# EAGLE design DSL40 switcher MIDI (EAGLE 9.6.2)
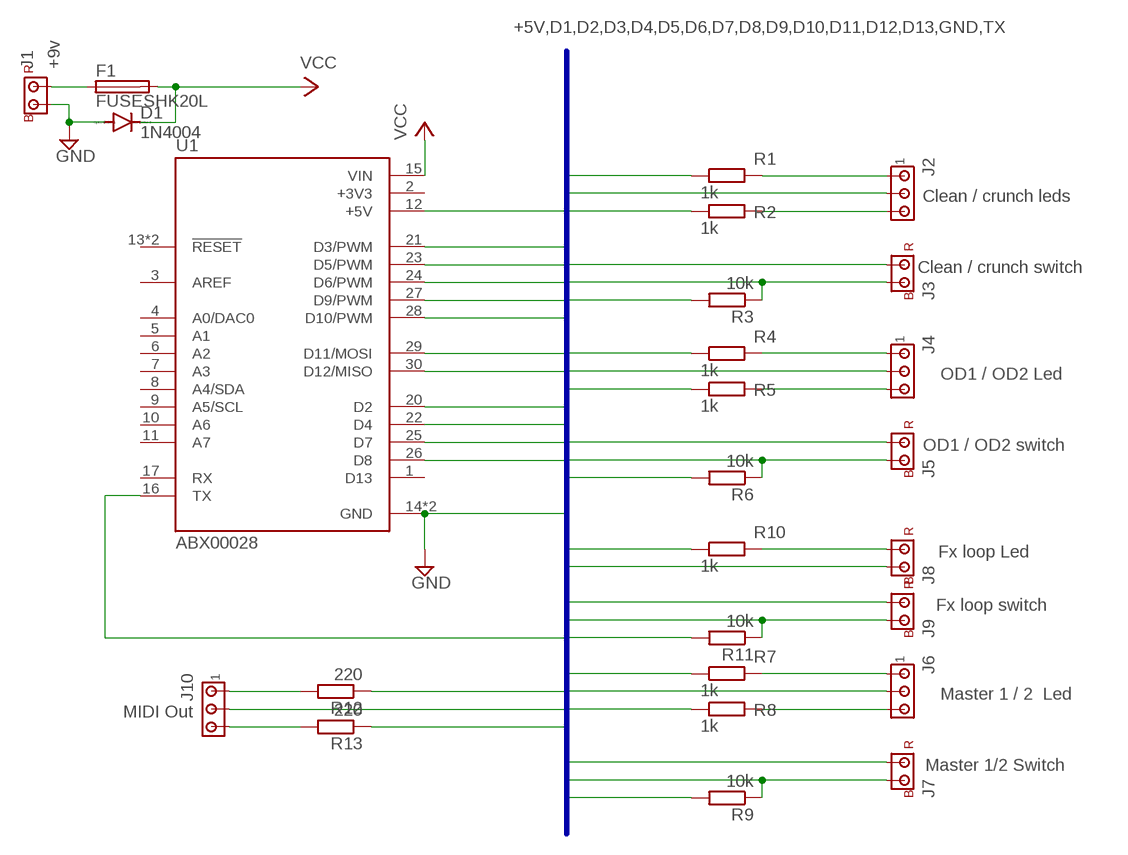
[diagram p0: schematic, sheet 1]

## Parts
D1  1N4004  [DO41-10]
F1  FUSESHK20L  [SHK20L]
J1  +9v  CONNECTOR-JST-2-2.54  [CONNECTOR-JST-2-2.54]
J2  Clean / crunch leds  CONNECTOR-JST-3-2.54  [CONNECTOR-JST-3-2.54]
J3  Clean / crunch switch  CONNECTOR-JST-2-2.54  [CONNECTOR-JST-2-2.54]
J4  OD1 / OD2 Led  CONNECTOR-JST-3-2.54  [CONNECTOR-JST-3-2.54]
J5  OD1 / OD2 switch  CONNECTOR-JST-2-2.54  [CONNECTOR-JST-2-2.54]
J6  Master 1 / 2 Led  CONNECTOR-JST-3-2.54  [CONNECTOR-JST-3-2.54]
J7  Master 1/2 Switch  CONNECTOR-JST-2-2.54  [CONNECTOR-JST-2-2.54]
J8  Fx loop Led  CONNECTOR-JST-2-2.54  [CONNECTOR-JST-2-2.54]
J9  Fx loop switch  CONNECTOR-JST-2-2.54  [CONNECTOR-JST-2-2.54]
J10  MIDI Out  CONNECTOR-JST-3-2.54  [CONNECTOR-JST-3-2.54]
R1  1k  R-EU_0207/10  [0207/10]
R2  1k  R-EU_0207/10  [0207/10]
R3  10k  R-EU_0207/10  [0207/10]
R4  1k  R-EU_0207/10  [0207/10]
R5  1k  R-EU_0207/10  [0207/10]
R6  10k  R-EU_0207/10  [0207/10]
R7  1k  R-EU_0207/10  [0207/10]
R8  1k  R-EU_0207/10  [0207/10]
R9  10k  R-EU_0207/10  [0207/10]
R10  1k  R-EU_0207/10  [0207/10]
R11  10k  R-EU_0207/10  [0207/10]
R12  220  R-EU_0207/10  [0207/10]
R13  220  R-EU_0207/10  [0207/10]
U1  ABX00028  [MODULE_ABX00028]

## Nets
+5V: J3.RED J5.RED J7.RED J9.RED R12.1 U1.12(+5V)
D2: J3.BLACK R3.1 U1.20(D2)
D3: R2.1 U1.21(D3/PWM)
D4: R1.1 U1.22(D4)
D5: J5.BLACK R6.1 U1.23(D5/PWM)
D6: R5.1 U1.24(D6/PWM)
D7: R4.1 U1.25(D7)
D8: J7.BLACK R9.1 U1.26(D8)
D9: R8.1 U1.27(D9/PWM)
D10: R7.1 U1.28(D10/PWM)
D11: R10.1 U1.29(D11/MOSI)
D12: J9.BLACK R11.1 U1.30(D12/MISO)
GND: D1.A J1.BLACK J2.BLACK J4.BLACK J6.BLACK J8.BLACK J10.BLACK R3.2 R6.2 R9.2 R11.2 U1.14(GND) U1.19(GND)
N$1: J2.YELLOW R2.2
N$2: J2.RED R1.2
N$3: J4.YELLOW R5.2
N$4: J4.RED R4.2
N$5: J8.RED R10.2
N$6: J6.RED R7.2
N$7: J6.YELLOW R8.2
N$8: J10.RED R12.2
N$9: J10.YELLOW R13.2
N$10: F1.1A J1.RED
TX: R13.1 U1.16(TX)
VCC: D1.C F1.2A U1.15(VIN)
Unconnected: U1.1(D13) U1.3(AREF) U1.4(A0/DAC0) U1.5(A1) U1.6(A2) U1.7(A3) U1.8(A4/SDA) U1.9(A5/SCL) U1.10(A6) U1.11(A7) U1.13(!RESET) U1.17(RX) U1.18(!RESET)

## Buses
+5V,D1,D2,D3,D4,D5,D6,D7,D8,D9,D10,D11,D12,D13,GND,TX

## Power pins joined to a net without a drawn wire
+3V3: U1.2(+3V3)

## Library data of the parts
D1 = diode:1N4004: DIODE general purpose rectifier, 1 A
F1 = fuse:FUSE: Fuse; OC_FARNELL: unknown; OC_NEWARK: unknown
J1 J3 J5 J7-J9 = christophe:CONNECTOR-JST-2-2.54: AMP connector
J2 J4 J6 J10 = christophe:CONNECTOR-JST-3-2.54: AMP connector
R1-R13 = christophe:R-EU_: RESISTOR, European symbol; SPICEPREFIX: R
U1 = Arduino every:ABX00028: Check availability <https://pricing.snapeda.com/parts/Arduino%20Nano%20Every/Arduino/view-part?ref=eda>; AVAILABILITY: In Stock; CHECK_PRICES: https://www.snapeda.com/parts/Arduino%20Nano%20Every/Arduino/view-part/?ref=eda; DESCRIPTION: Arduino’s 5V compatible board in the smallest available form factor: 45x18mm!; MF: Arduino; MP: Arduino Nano Every; PACKAGE: None; PRICE: None; SNAPEDA_LINK: https://www.snapeda.com/parts/Arduino%20Nano%20Every/Arduino/view-part/?ref=snap

## Board
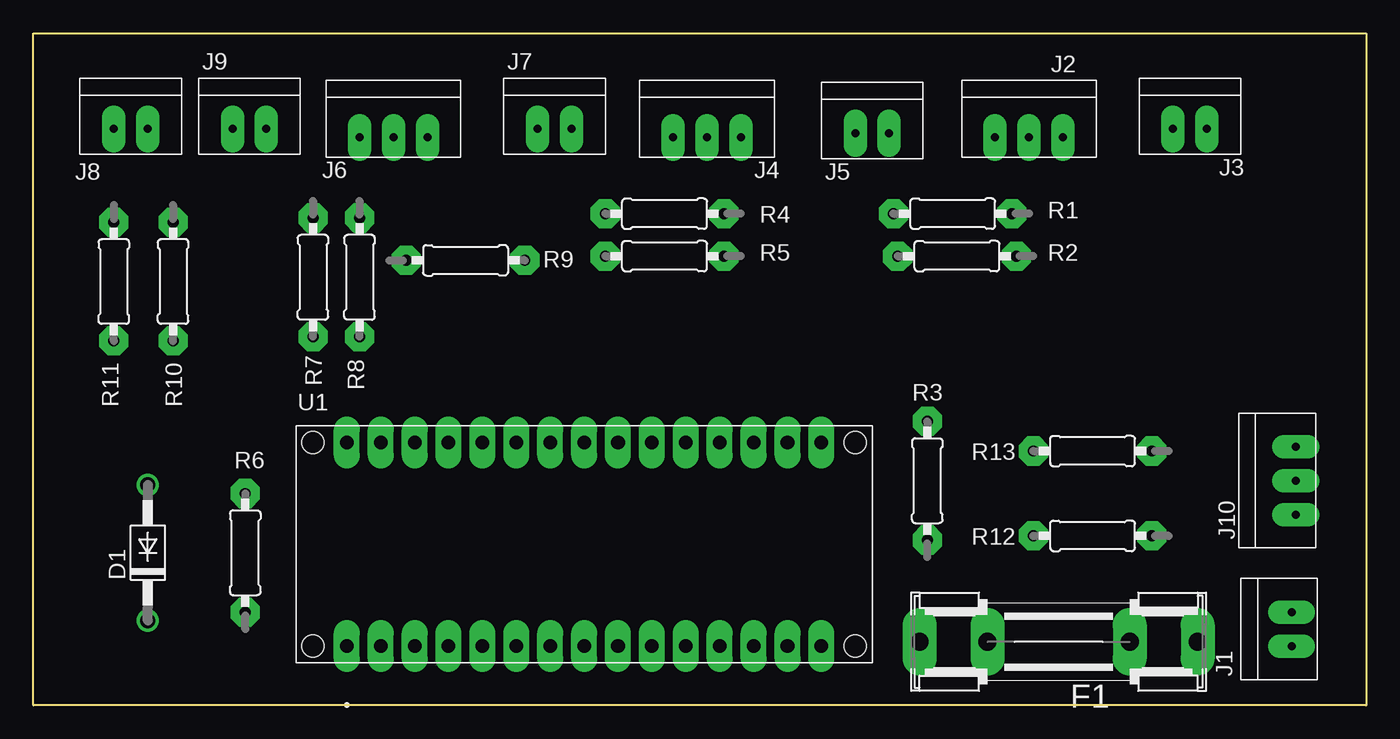
[diagram p1: board, top side]
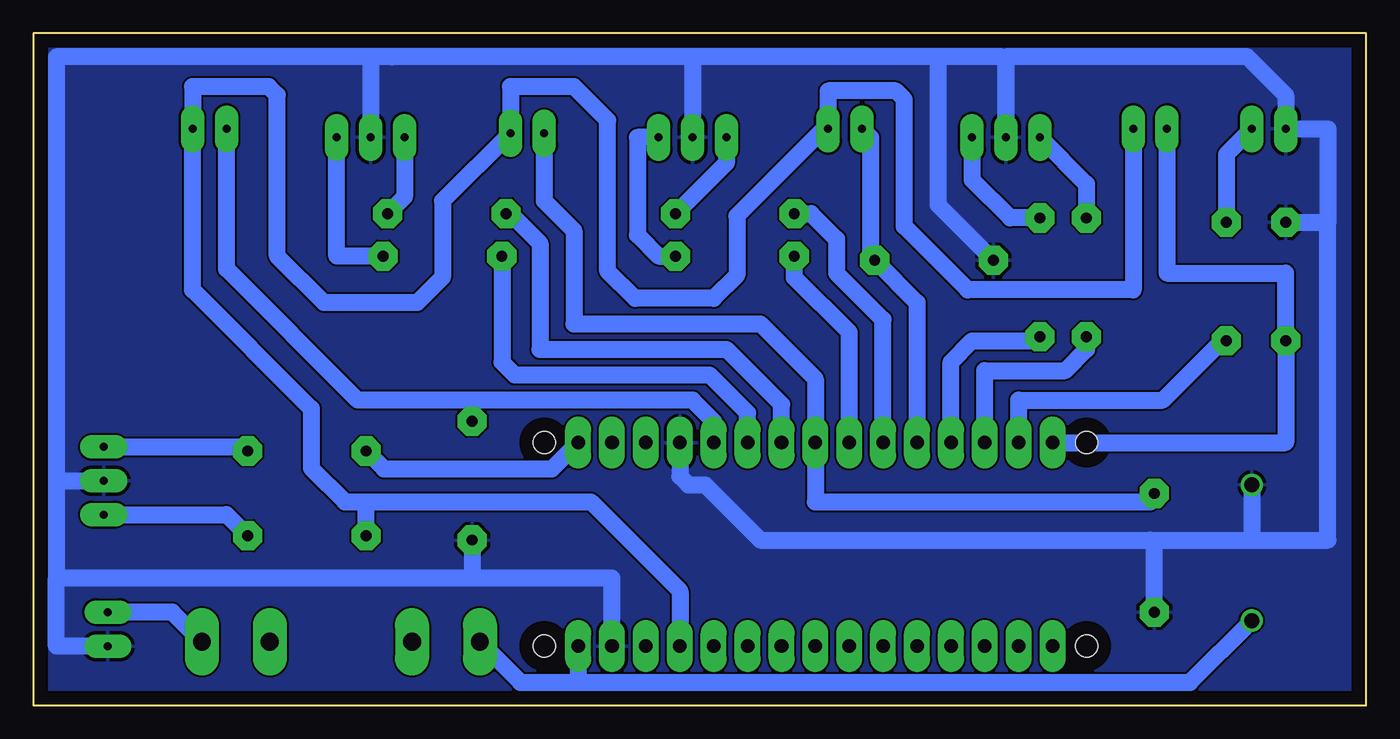
[diagram p2: board, bottom side, seen from below]

Size 99.88 x 50.34 mm. Coordinates in mm from the lower left corner, seen from the top.
Outline: 0,0 0,50.34 99.88,50.34 99.88,0 0,0
Copper layers (1*16): Top 0.035mm / dielectric 1.5mm / Bottom 0.035mm
Design rules "default": minimum track width 6mil, minimum drill 0.35mm, track to track 6mil, track to pad 6mil, pad to pad 6mil, via to via 6mil, smd to smd 6mil, copper to edge 40mil, drill to drill 6mil, minimum pad ring 10mil, minimum via ring 8mil, stop-mask expansion 4mil, vias tented up to drill 0mil, thermal gap 10mil

### Footprints (pad centres in the part's own frame; a part is rotated, then mirrored left to right if it is on the bottom)
DO41-10 = drill 1.118: A 5.08,0; C -5.08,0
SHK20L = drill 1.321 pad 2.54 long: 1A -10.414,0; 1B -5.334,0; 2A 10.414,0; 2B 5.334,0
CONNECTOR-JST-2-2.54 = drill 0.6 pad 1.778 long: BLACK 0,0; RED 2.54,0
CONNECTOR-JST-3-2.54 = drill 0.6 pad 1.778 long: BLACK 2.54,0; RED 0,0; YELLOW 5.08,0
0207/10 = drill 0.813 pad 2.184 octagon: 1 -5.08,0; 2 3.81,0
MODULE_ABX00028 = drill 1.016 pad 1.93 long: 1 -17.78,-7.62; 2 -15.24,-7.62; 3 -12.7,-7.62; 4 -10.16,-7.62; 5 -7.62,-7.62; 6 -5.08,-7.62; 7 -2.54,-7.62; 8 0,-7.62; 9 2.54,-7.62; 10 5.08,-7.62; 11 7.62,-7.62; 12 10.16,-7.62; 13 12.7,-7.62; 14 15.24,-7.62; 15 17.78,-7.62; 16 17.78,7.62; 17 15.24,7.62; 18 12.7,7.62; 19 10.16,7.62; 20 7.62,7.62; 21 5.08,7.62; 22 2.54,7.62; 23 0,7.62; 24 -2.54,7.62; 25 -5.08,7.62; 26 -7.62,7.62; 27 -10.16,7.62; 28 -12.7,7.62; 29 -15.24,7.62; 30 -17.78,7.62 | hole 1.651: -20.32,-7.62; -20.32,7.62; 20.32,7.62; 20.32,-7.62

### Placement (x,y rotation side)
D1  8.57,11.43 90 top
F1  76.83,4.76 180 top
J1  94.3,4.45 90 top
J2  72.07,42.55 0 top
J3  85.41,43.18 0 top
J4  47.94,42.55 0 top
J5  61.59,42.86 0 top
J6  24.45,42.55 0 top
J7  37.78,43.18 0 top
J8  6.03,43.18 0 top
J9  14.92,43.18 0 top
J10  94.61,14.29 90 top
R1  69.53,36.83 0 top
R2  69.85,33.66 0 top
R3  66.99,16.19 270 top
R4  47.94,36.83 0 top
R5  47.94,33.66 0 top
R6  15.88,10.79 270 top
R7  20.95,32.7 90 top
R8  24.45,32.7 90 top
R9  31.75,33.34 180 top
R10  10.48,32.38 90 top
R11  6.03,32.38 90 top
R12  80.01,12.7 0 top
R13  80.01,19.05 0 top
U1  41.27,12.06 0 top

### Tracks (layer width: path | path; a pad name or v marks a point on that pad's centre or on a via)
+5V
  Bottom 1.27: J9.RED 17.46,31.11 29.84,31.11 34.61,35.88 34.61,45.4 35.24,46.04 40.32,46.04 J7.RED 40.64,43.18 47.16,36.66 47.16,32.22 48.9,30.48 54.77,30.48 56.83,32.54 56.83,43.81 59.37,46.35 64.14,46.35 J5.RED 69.22,37.78 69.22,32.07 71.12,30.16 78.11,30.16 81.6,33.66 81.6,45.72 82.23,46.35 87.95,46.35 J3.RED 87.95,31.11 79.06,22.23 79.06,17.78 76.52,15.24 74.93,15.24 | U1.12 51.44,8.57 58.1,15.24 74.93,15.24 | R12.1 74.93,15.24
D2
  Bottom 1.27: U1.20 48.9,21.27 50.48,22.86 66.99,22.86 | 66.99,22.86 R3.1 | 66.99,22.86 75.56,22.86 85.41,32.7 J3.BLACK
D3
  Bottom 1.27: U1.21 46.35,21.91 49.21,24.77 63.82,24.77 64.77,25.72 R2.1
D4
  Bottom 1.27: U1.22 43.81,22.54 47.94,26.67 61.91,26.67 61.91,34.61 64.14,36.83 R1.1
D5
  Bottom 1.27: J5.BLACK 61.59,37.78 59.37,35.56 59.37,28.57 45.4,28.57 41.27,24.45 U1.23 41.27,15.24 16.19,15.24 15.88,15.56 R6.1
D6
  Bottom 1.27: U1.24 38.73,27.94 42.86,32.07 R5.1
D7
  Bottom 1.27: U1.25 36.2,28.89 39.69,32.38 39.69,34.92 41.59,36.83 R4.1
D8
  Bottom 1.27: U1.26 33.66,30.16 R9.1 37.15,33.66 37.15,42.55 J7.BLACK
D9
  Bottom 1.27: U1.27 31.11,25.72 29.53,27.3 24.77,27.3 R8.1
D10
  Bottom 1.27: R7.1 20.95,26.67 22.54,25.08 28.57,25.08 U1.28
D11
  Bottom 1.27: U1.29 26.04,22.86 15.24,22.86 10.79,27.3 R10.1
D12
  Bottom 1.27: J9.BLACK 14.92,32.38 6.03,32.38 R11.1 6.03,19.68 U1.30
GND
  Bottom 1.27: 32.07,48.58 50.48,48.58 | 50.48,48.58 J4.BLACK | 50.48,48.58 73.03,48.58 | 73.03,48.58 74.61,48.58 | 73.03,48.58 73.03,48.61 | 74.61,48.58 J2.BLACK | 74.61,48.58 98.15,48.58 98.15,16.83 | 98.15,16.83 J10.BLACK 93.98,16.83 | 98.15,9.53 98.15,4.45 J1.BLACK | U1.14 56.52,9.53 66.99,9.53 | 66.99,9.53 98.15,9.53 | U1.19 51.44,17.14 50.8,16.51 49.53,16.51 45.4,12.38 16.19,12.38 | 16.19,12.38 8.26,12.38 | 8.26,12.38 2.86,12.38 2.86,36.2 | R11.2 2.86,36.2 | 2.86,36.2 2.86,43.18 J8.BLACK 6.03,45.72 8.89,48.58 26.99,48.58 J6.BLACK 26.99,48.26 27.3,48.58 32.07,48.58 | R3.2 66.99,9.53 | 98.15,16.83 98.15,9.53 | 32.07,48.58 32.07,37.47 R9.2 | R6.2 15.88,12.06 16.19,12.38 | D1.A 8.57,12.7 8.26,12.38
  pour Bottom: -1.59,51.44 -1.59,-0.95 0.32,-2.86 98.42,-2.86 102.55,1.27 102.55,53.34 0.32,53.34
N$1
  Bottom 1.27: R2.2 77.15,33.66 J2.YELLOW
N$2
  Bottom 1.27: J2.RED 72.07,38.1 R1.2
N$3
  Bottom 1.27: R5.2 53.02,33.66 54.61,35.24 54.61,42.55 J4.YELLOW
N$4
  Bottom 1.27: R4.2 47.94,40.64 J4.RED
N$5
  Bottom 1.27: J8.RED 10.48,41.27 R10.2
N$6
  Bottom 1.27: J6.RED 20.95,39.05 R7.2
N$7
  Bottom 1.27: R8.2 26.67,36.51 29.53,39.37 J6.YELLOW
N$8
  Bottom 1.27: J10.RED 85.41,14.29 R12.2
N$9
  Bottom 1.27: J10.YELLOW 84.14,19.37 R13.2
N$10
  Bottom 1.27: F1.1A 89.47,6.99 J1.RED
TX
  Bottom 1.27: R13.1 73.6,17.72 61.02,17.72 U1.16
VCC
  Bottom 1.27: F1.2A 63.39,1.73 59.05,1.73 | 59.05,1.73 13.2,1.73 D1.C | U1.15 59.05,1.73